# EAGLE schematic Amplifiers (EAGLE 8.6.1)
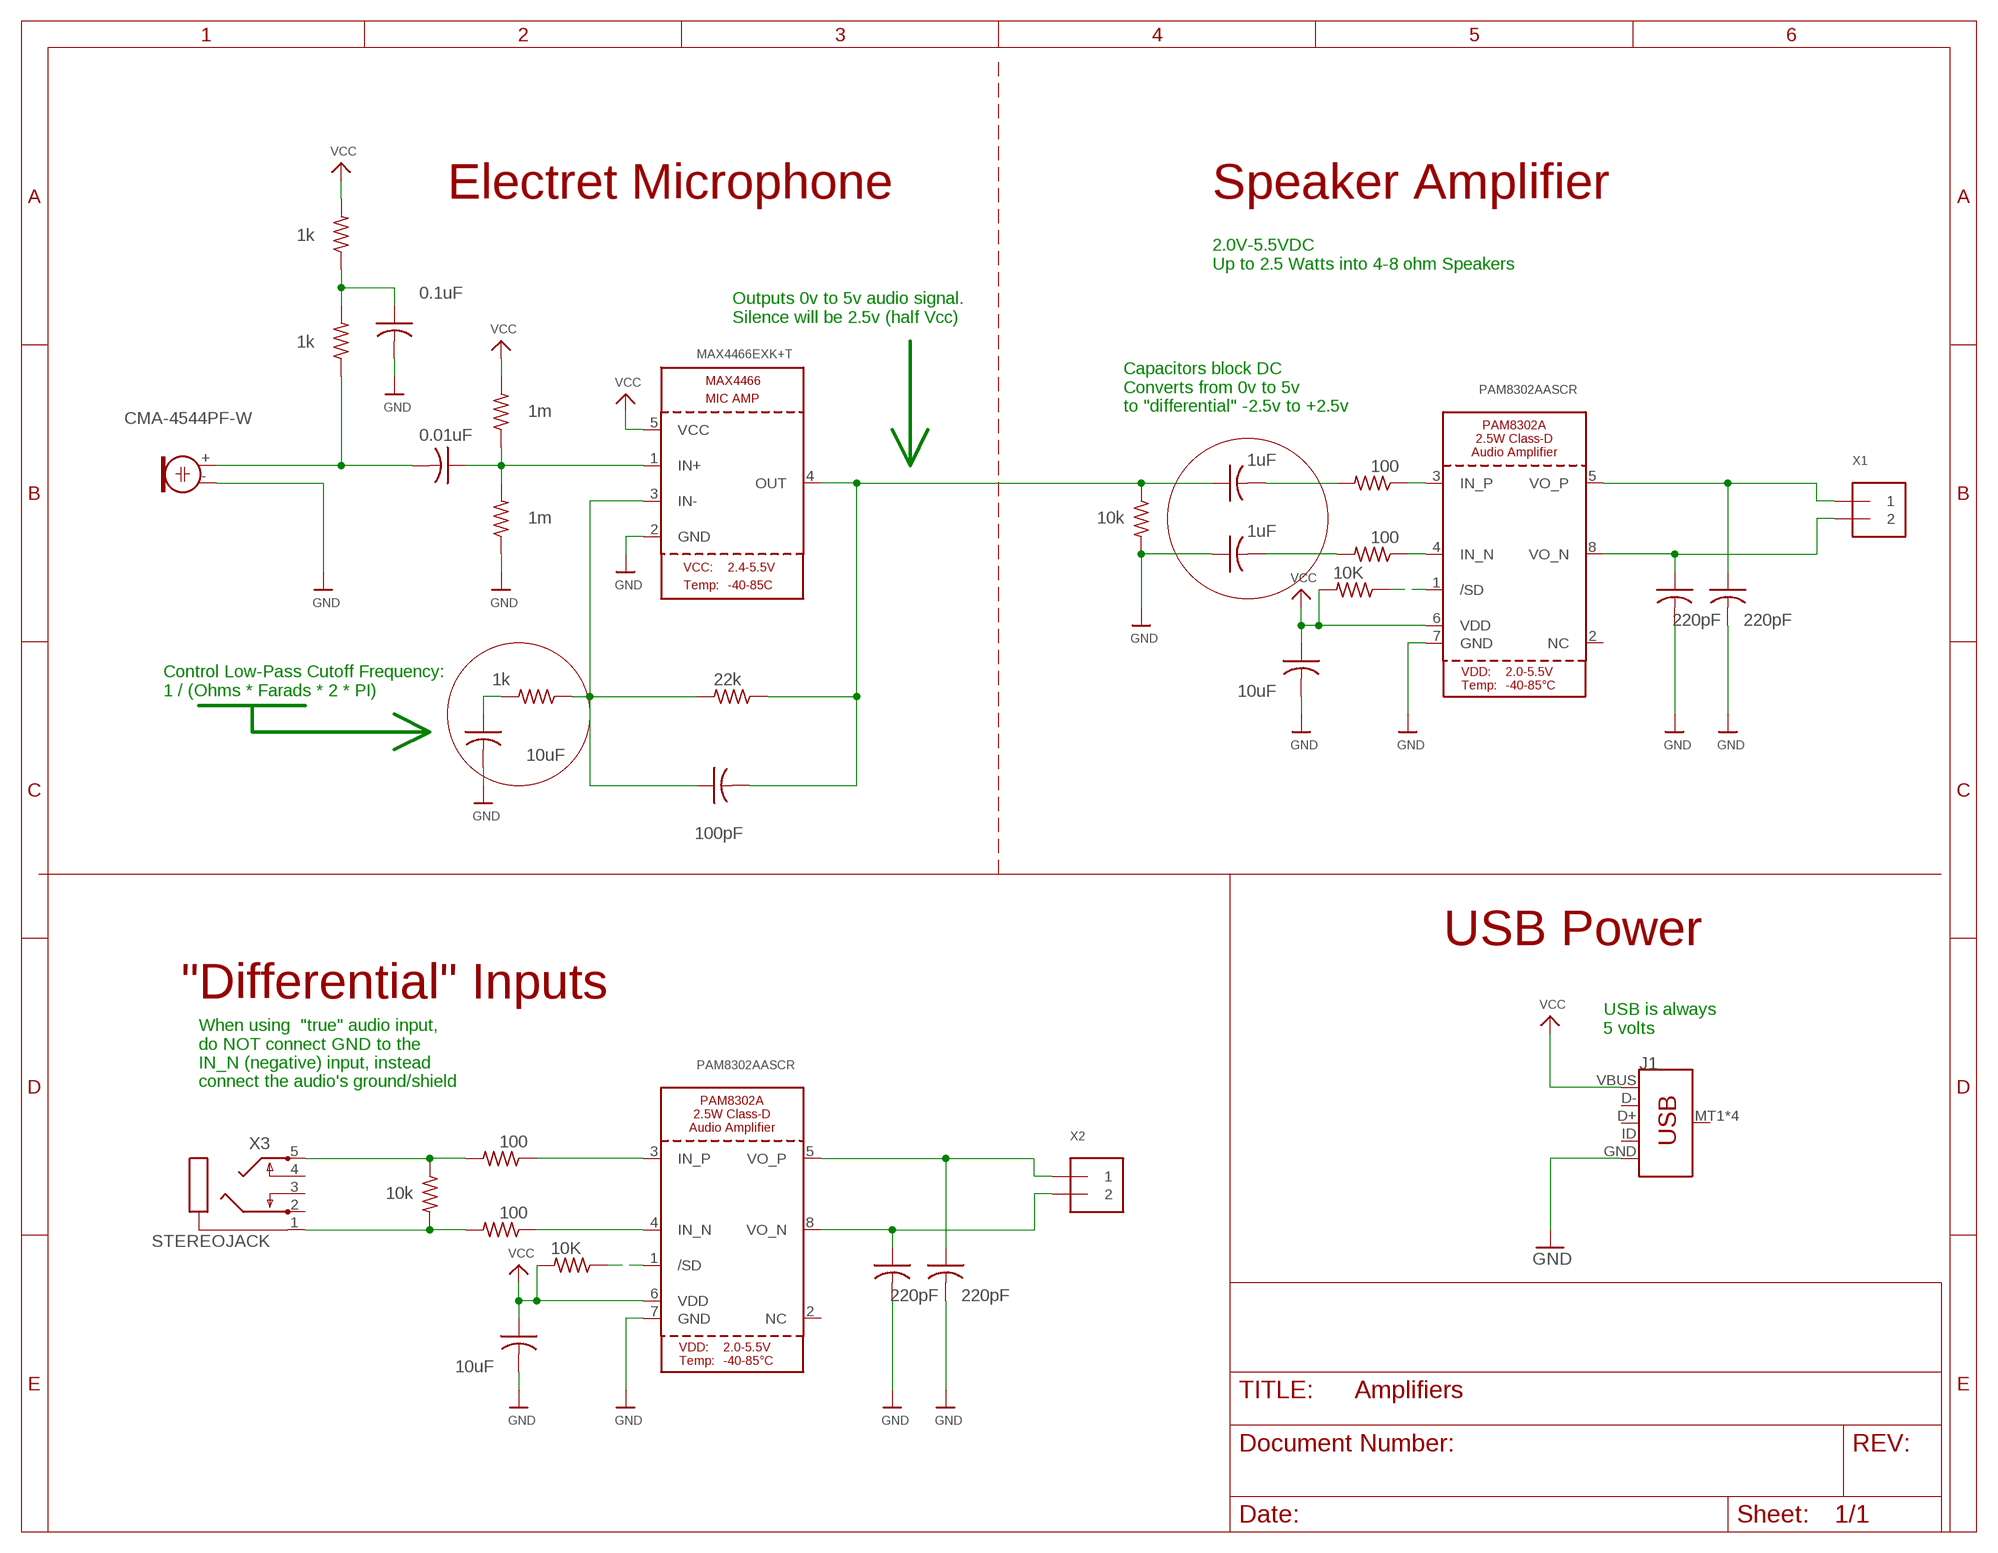
[diagram p0: schematic, sheet 1]

## Parts
C1  0.01uF  C-USC0603  [C0603]
C2  10uF  C-USC0603  [C0603]
C3  0.1uF  C-USC0603  [C0603]
C4  220pF  C-USC0603  [C0603]
C5  10uF  C-USC0603  [C0603]
C6  100pF  C-USC0603  [C0603]
C7  220pF  C-USC0603  [C0603]
C10  1uF  C-USC0603  [C0603]
C11  1uF  C-USC0603  [C0603]
C12  10uF  C-USC0603  [C0603]
C13  220pF  C-USC0603  [C0603]
C14  220pF  C-USC0603  [C0603]
J1  USB_MICRO-B_SMT  [USB-MICROB]
Q1  CMA-4544PF-W  ELECTRET  [ELECTRET_9.7]
R1  10k  R-US_R0603  [R0603]
R2  10K  R-US_R0603  [R0603]
R3  100  R-US_R0603  [R0603]
R4  10k  R-US_R0603  [R0603]
R5  10K  R-US_R0603  [R0603]
R6  1k  R-US_R0603  [R0603]
R7  100  R-US_R0603  [R0603]
R8  1k  R-US_R0603  [R0603]
R9  1m  R-US_R0603  [R0603]
R10  1m  R-US_R0603  [R0603]
R11  1k  R-US_R0603  [R0603]
R12  22k  R-US_R0603  [R0603]
R13  100  R-US_R0603  [R0603]
R14  100  R-US_R0603  [R0603]
U1  MAX4466EXK+T  MAX4466""  [SC70-5]
U2  PAM8302AASCR  AUDIOAMP_PAM8302A  [MSOP8_0.65MM]
U3  PAM8302AASCR  AUDIOAMP_PAM8302A  [MSOP8_0.65MM]
X1  TERMBLOCK_1X2  [TERMBLOCK_1X2-3.5MM]
X2  TERMBLOCK_1X2  [TERMBLOCK_1X2-3.5MM]
X3  STEREOJACK  [STX3100]

## Nets
AIN+: C6.2 C10.1 R4.1 R12.1 U1.4(OUT)
AIN+1: R1.1 R14.2 X3.5
GND: C2.2 C3.2 C4.2 C5.2 C7.2 C11.1 C12.2 C13.2 C14.2 J1.GND Q1.- R4.2 R10.1 U1.2(GND) U2.7(GND) U3.7(GND)
N$1: C6.1 R11.1 R12.2 U1.3(IN-)
N$2: R3.1 U3.4(IN_N)
N$3: C1.2 Q1.+ R8.1
N$4: C3.1 R6.1 R8.2
N$5: C1.1 R9.1 R10.2 U1.1(IN+)
N$6: R7.1 U2.4(IN_N)
N$7: C5.1 R11.2
N$9: R13.1 U2.3(IN_P)
N$10: C11.2 R7.2
N$11: R14.1 U3.3(IN_P)
N$12: R1.2 R3.2 X3.1
N$13: C10.2 R13.2
N$14: R2.1 U3.1(/SD)
N$15: R5.1 U2.1(/SD)
VCC: C2.1 C12.1 J1.VBUS R2.2 R5.2 R6.2 R9.2 U1.5(VCC) U2.6(VDD) U3.6(VDD)
VO+: C7.1 U2.5(VO_P) X1.1
VO+1: C14.1 U3.5(VO_P) X2.1
VO-: C4.1 U2.8(VO_N) X1.2
VO-1: C13.1 U3.8(VO_N) X2.2
Unconnected: J1.D+ J1.D- J1.ID J1.MT1(SHIELD) J1.MT2(SHIELD) J1.P$1(SHIELD) J1.P$2(SHIELD) U2.2(NC) U3.2(NC) X3.2 X3.3 X3.4

## Notes on the sheet
- Electret Microphone | Speaker Amplifier
- 2.0V-5.5VDC
  Up to 2.5 Watts into 4-8 ohm Speakers
- Outputs 0v to 5v audio signal.
  Silence will be 2.5v (half Vcc)
- Capacitors block DC
  Converts from 0v to 5v
  to "differential" -2.5v to +2.5v
- Control Low-Pass Cutoff Frequency:
  1 / (Ohms * Farads * 2 * PI)
- USB Power
- "Differential" Inputs
- USB is always
  5 volts
- When using  "true" audio input,
  do NOT connect GND to the
  IN_N (negative) input, instead
  connect the audio's ground/shield

## Library data of the parts
C1-C7 C10-C14 = adafruit:C-US: CAPACITOR, American symbol
J1 = SparkFun-Connectors:USB_MICRO-B: USB Type Micro-B Connector Male/female and PTH/SMT variants SparkFun Products: SparkFun microB USB Breakout <https://www.sparkfun.com/products/12035> SparkFun USB microB Plug Breakout <https://www.sparkfun.com/products/10031> SparkFun ESP8266 Thing <https://www.sparkfun.com/products/13231>; PROD_ID: CONN-09505; SF_ID: PRT-08533
Q1 = microbuilder:ELECTRET: Electret microphone Thru hole 2.54mm spacing with 9.7mm diameter
R1-R14 = adafruit:R-US_: RESISTOR, American symbol
U1 = microbuilder:MAX4466: MAX4466 - Microphone Pre-Amp
U2 U3 = microbuilder:AUDIOAMP_PAM8302A: PAM8302A - 2.5W Class-D Mono Audio Amplifier MSOP8 = PAM8302AASCR
X1 X2 = microbuilder:TERMBLOCK_1X2: 3.5mm Terminal block http://www.ladyada.net/library/pcb/eaglelibrary.html
X3 = adafruit:STEREOJACK: MIC/HEADPHONE JACK Stereo jack with two switches. Kycon STX3100, CUI SJ1-3555NG and/or 4UCon 05544